# Altium schematic sheet PLL1.SchDoc
size A; SheetNumber: 4; SheetTotal: 9
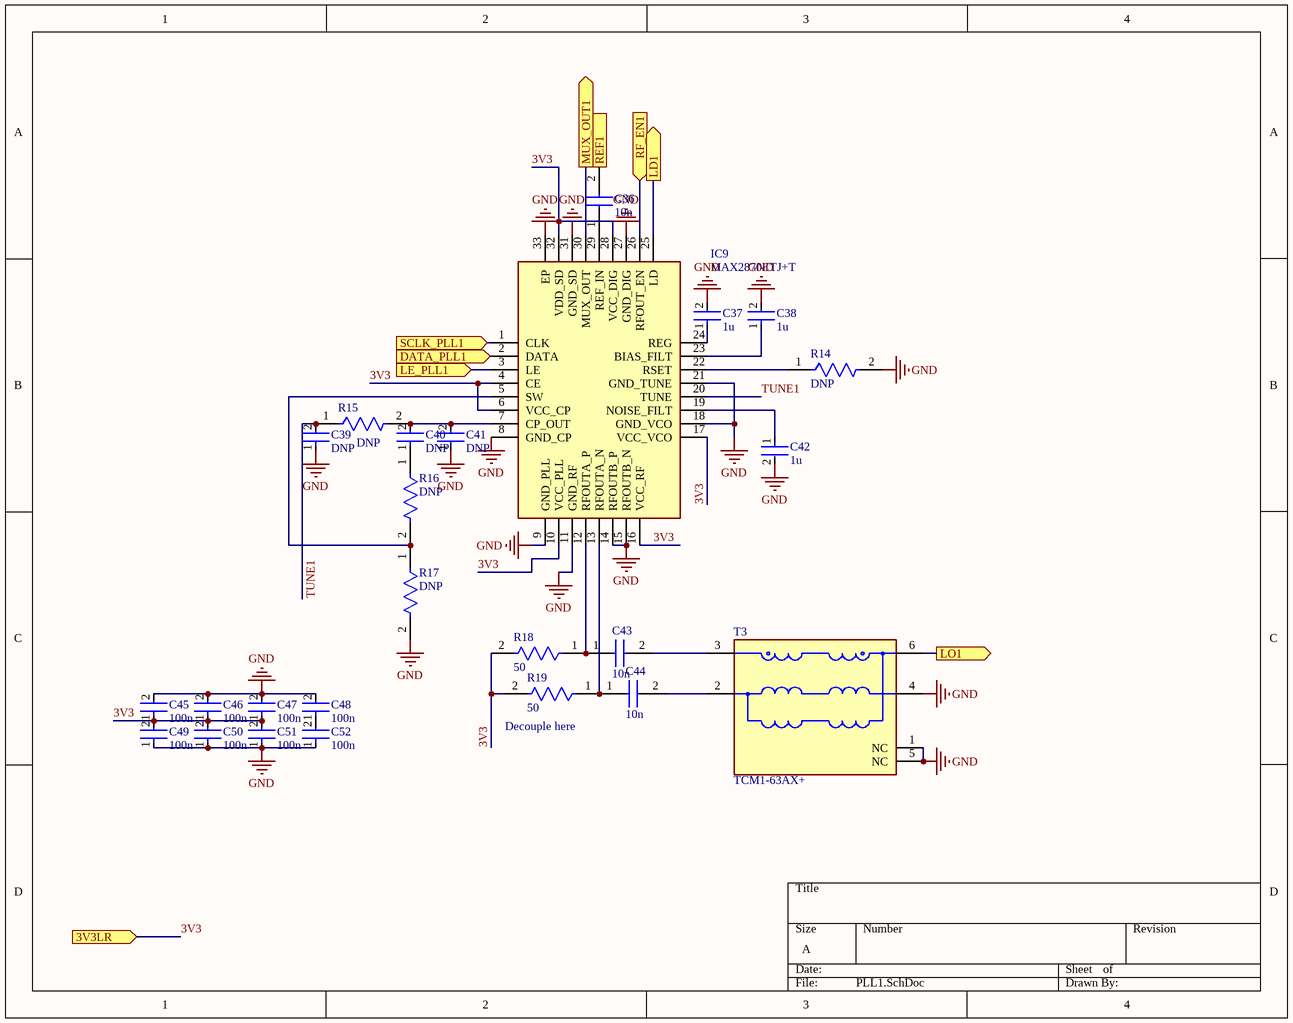
[diagram p0: PLL1.SchDoc]

## Parts
C36  10n  [CAPC1005X61N]
C37  1u  [FP-GRM155-0_1-MFG]
C38  1u  [FP-GRM155-0_1-MFG]
C39  DNP  [FP-GRM155-0_05-IPC_C]  (no BOM)
C40  DNP  [FP-GRM155-0_05-IPC_C]  (no BOM)
C41  DNP  [FP-GRM155-0_05-IPC_C]  (no BOM)
C42  1u  [FP-GRM155-0_1-MFG]
C43  10n  [CAPC1005X61N]
C44  10n  [CAPC1005X61N]
C45  100n  [FP-GRM155-0_05-IPC_C]
C46  100n  [FP-GRM155-0_05-IPC_C]
C47  100n  [FP-GRM155-0_05-IPC_C]
C48  100n  [FP-GRM155-0_05-IPC_C]
C49  100n  [FP-GRM155-0_05-IPC_C]
C50  100n  [FP-GRM155-0_05-IPC_C]
C51  100n  [FP-GRM155-0_05-IPC_C]
C52  100n  [FP-GRM155-0_05-IPC_C]
IC9  MAX2870ETJ+T  [QFN50P500X500X80-33N]
R14  DNP  [FP-AC0402-IPC_B]  (no BOM)
R15  DNP  [FP-AC0402-IPC_B]  (no BOM)
R16  DNP  [FP-AC0402-IPC_B]  (no BOM)
R17  DNP  [FP-AC0402-IPC_B]  (no BOM)
R18  50  [FP-RC0402-0_4-MFG]
R19  50  [FP-RC0402-0_4-MFG]
T3  TCM1-63AX+  [FP-TCM1-63AX+-MFG]

## Ports
3V3LR (in), DATA_PLL1 (in), LD1 (out), LE_PLL1 (in), LO1 (out), MUX_OUT1 (out), REF1 (in), RF_EN1 (in), SCLK_PLL1 (in)

## Nets
GND: C37.2 C38.2 C39.1 C41.1 C42.2 C45.2 C46.2 C47.2 C48.2 C49.1 C50.1 C51.1 C52.1 IC9.8(GND_CP) IC9.9(GND_PLL) IC9.11(GND_RF) IC9.14(RFOUTB_P) IC9.15(RFOUTB_N) IC9.18(GND_VCO) IC9.21(GND_TUNE) IC9.27(GND_DIG) IC9.31(GND_SD) IC9.33(EP) R14.2 R17.2 T3.1(NC) T3.4(SECONDARY) T3.5(NC)
3V3: C45.1 C46.1 C47.1 C49.2 C50.2 C51.2 IC9.4(CE) IC9.6(VCC_CP) IC9.10(VCC_PLL) IC9.16(VCC_RF) IC9.17(VCC_VCO) IC9.28(VCC_DIG) IC9.32(VDD_SD) R18.2 R19.2 ; port 3V3LR
DATA_PLL1: IC9.2(DATA) ; port DATA_PLL1
LD1: IC9.25(LD) ; port LD1
LE_PLL1: IC9.3(LE) ; port LE_PLL1
LO1: T3.6(SECONDARY_DOT) ; port LO1
MUX_OUT1: IC9.30(MUX_OUT) ; port MUX_OUT1
REF1: C36.2 ; port REF1
RF_EN1: IC9.26(RFOUT_EN) ; port RF_EN1
SCLK_PLL1: IC9.1(CLK) ; port SCLK_PLL1
TUNE1: C39.2 IC9.20(TUNE) R15.1
NetC36_1: C36.1 IC9.29(REF_IN)
NetC37_1: C37.1 IC9.24(REG)
NetC38_1: C38.1 IC9.23(BIAS_FILT)
NetC40_1: C40.1 R16.1
NetC40_2: C40.2 C41.2 IC9.7(CP_OUT) R15.2
NetC42_1: C42.1 IC9.19(NOISE_FILT)
NetC43_1: C43.1 IC9.12(RFOUTA_P) R18.1
NetC43_2: C43.2 T3.3(PRIMARY_DOT)
NetC44_1: C44.1 IC9.13(RFOUTA_N) R19.1
NetC44_2: C44.2 T3.2(GND)
NetC48_1: C48.1 C52.2
NetIC9_5: IC9.5(SW) R16.2 R17.1
NetIC9_22: IC9.22(RSET) R14.1

## Notes on the sheet
- (near R19) Decouple here

## Library data of the parts
C36 C43 C44 = 520L103KT16T: Capacitor; Manufacturer_Name: ATC / Kyocera AVX; Datasheet Link: https://rfs.kyocera-avx.com/userFiles/uploads/pdfs/520l.pdf; Height: 0.61mm; Manufacturer_Part_Number: 520L103KT16T; Mouser Part Number: 581-520L103KT16T; Mouser Price/Stock: https://www.mouser.co.uk/ProductDetail/ATC-KYOCERA-AVX/520L103KT16T?qs=1tb21EFCQjo0F0Wws%2FObWA%3D%3D
C37 C38 C42 = CMP-06035-041084-1: Chip Multilayer Ceramic Capacitors for General Purpose, 0402, 1.0uF, X5R, 15%, 10%, 50V
C39-C41 C45-C52 = CMP-06035-008289-1: Chip Multilayer Ceramic Capacitors for General Purpose, 0402, 0.10uF, X5R, 15%, 10%, 100V; Capacitance: 100nF; Case Code (Metric): 1005; Width: 0.5mm; Case/Package: 0402; Case Code (Imperial): 0402; Voltage Rating (DC): 100V; Package Quantity: 10000; Length: 0.039inch; Height: 0.5mm; Max Operating Temperature: 85°C; Lead Free: Lead Free; Termination: SMD/SMT; Mount: Surface Mount; Tolerance: 10%; Packaging: Tape and Reel; Voltage Rating: 100V; Thickness: 0.022inch; Dielectric: X5R; REACH SVHC: No SVHC; Min Operating Temperature: -55°C; Weight: 0.000212oz
IC9 = MAX2870ETJ+T: Integrated Circuit; Manufacturer_Name: Analog Devices; Datasheet Link: https://datasheets.maximintegrated.com/en/ds/MAX2870.pdf; Height: 0.8mm; Manufacturer_Part_Number: MAX2870ETJ+T; Mouser Part Number: 700-MAX2870ETJ+T; Mouser Price/Stock: https://www.mouser.co.uk/ProductDetail/Analog-Devices-Maxim-Integrated/MAX2870ETJ%2bT?qs=UFD7vfw3J8rIUAsp8guXHg%3D%3D; Arrow Part Number: MAX2870ETJ+T; Arrow Price/Stock: https://www.arrow.com/en/products/max2870etjt/maxim-integrated?region=nac
R14-R17 = CMP-03412-003052-2: RES 13.3kΩ ±1% 0.063W 0402; Resistance: 13.3kR; Power Rating: 62.5mW; Max Power Dissipation: 63mW; Voltage Rating: 50V; Temperature Coefficient: 100ppm/°C; Series: AC; Width: 0.5mm; Number of Terminations: 2; Features: Moisture Resistant; Packaging: Tape and Reel; Case Code (Imperial): 0402; Resistor Type: Thick Film; Case/Package: 0402; Length: 0.039inch; RoHS Compliant: Yes; Tolerance: 1%; Case Code (Metric): 1005; Height: 0.015inch; Termination: SMD/SMT; Min Operating Temperature: -55°C; Max Operating Temperature: 155°C
R18 R19 = CMP-00621-24490980-1: RC0402JR-0750RL SMD Chip Resistor, 50 Ohm, ± 5%, 63 mW, 0402 [1005 Metric], Thick Film, General Purpose; Temperature Coefficient: 100ppm/°C; Max Power Dissipation: 63mW; Resistance: 50Ω; Width: 508µm; RoHS: Compliant; Height: 406.4µm; Length: 990.6µm; Features: Moisture Resistant; Tolerance: 5%; Lead Free: Lead Free; Case/Package: 0402; NexarPartId: 24490980; Min Operating Temperature: -55°C; Composition: Thick Film; Packaging: Tape & Reel (TR); Schedule B: 8533210045, 8533210045; Number of Terminations: 2; Max Operating Temperature: 155°C
T3 = CMP-199822-000001-1: 1:1 CORE & WIRE Transformer, 10 - 6000 MHz, 50Ω; Manufacturer: Mini-Circuits; Insertion Loss: 1.16-1.8dB; Return Loss: 9.42-16.9dB; Lead Free: Yes; Device Class L3: unset; Temperature: -40°C to +85°C; Manufacturer Part Number: TCM1-63AX+; Frequency: 10-6000MHz; Device Class L2: Transformers; RoHS: TRUE; Octopart: https://octopart.com/tcm1-63ax%2B-mini-circuits-107315723; Temperature Range Low: -40°C; Category: Trans; Package: 0; ComponentLink2URL: https://www.minicircuits.com/pdfs/TCM1-63AX+.pdf; ComponentLink2Description: Datasheet; Automotive: No; Height: 4.06mm; Device Class L1: Passive Components; Temperature Range High: +85°C; Turns Ratio: 1:1